# Altium schematic sheet SO_DO_DK_TONG_THE_MAY_GHI_HINH_9_9_2021.SchDoc
size A1
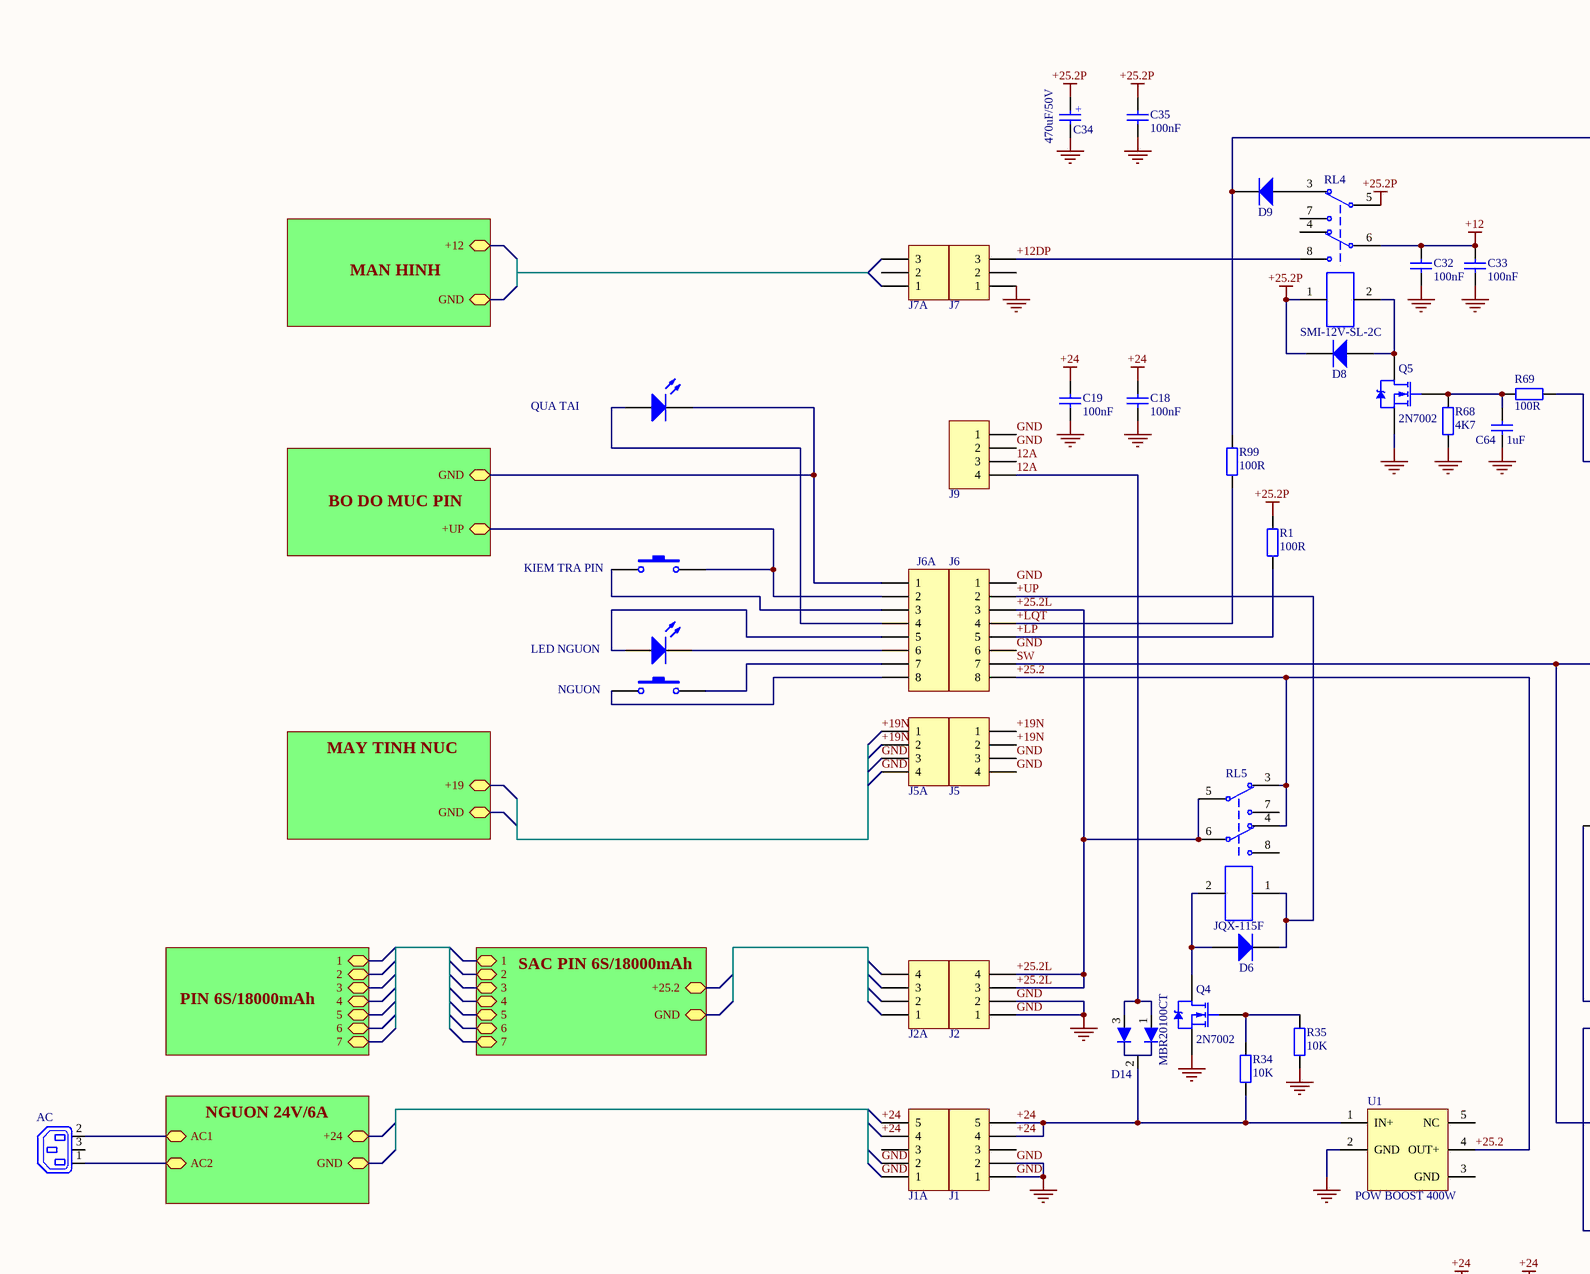
[diagram p0: SO_DO_DK_TONG_THE_MAY_GHI_HINH_9_9_2021.SchDoc, top left]
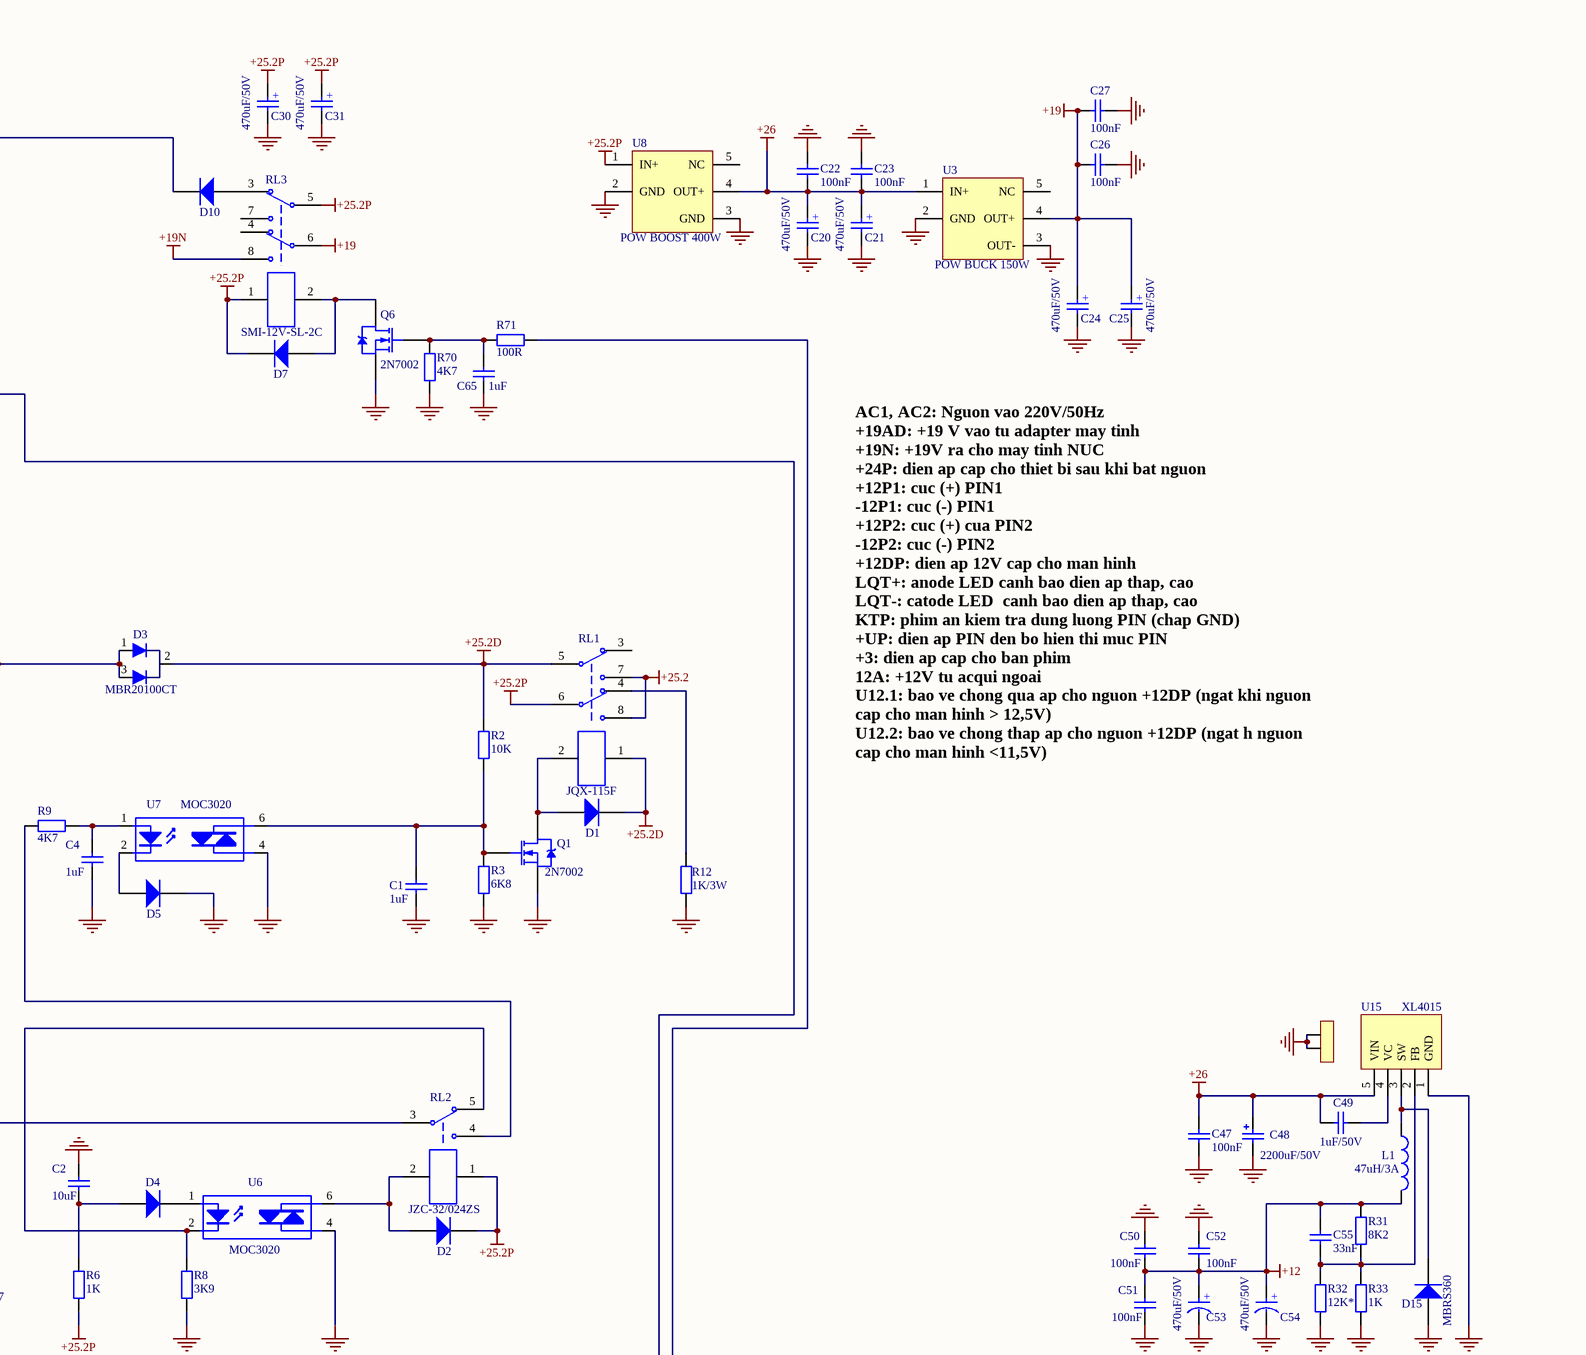
[diagram p1: SO_DO_DK_TONG_THE_MAY_GHI_HINH_9_9_2021.SchDoc, top right]
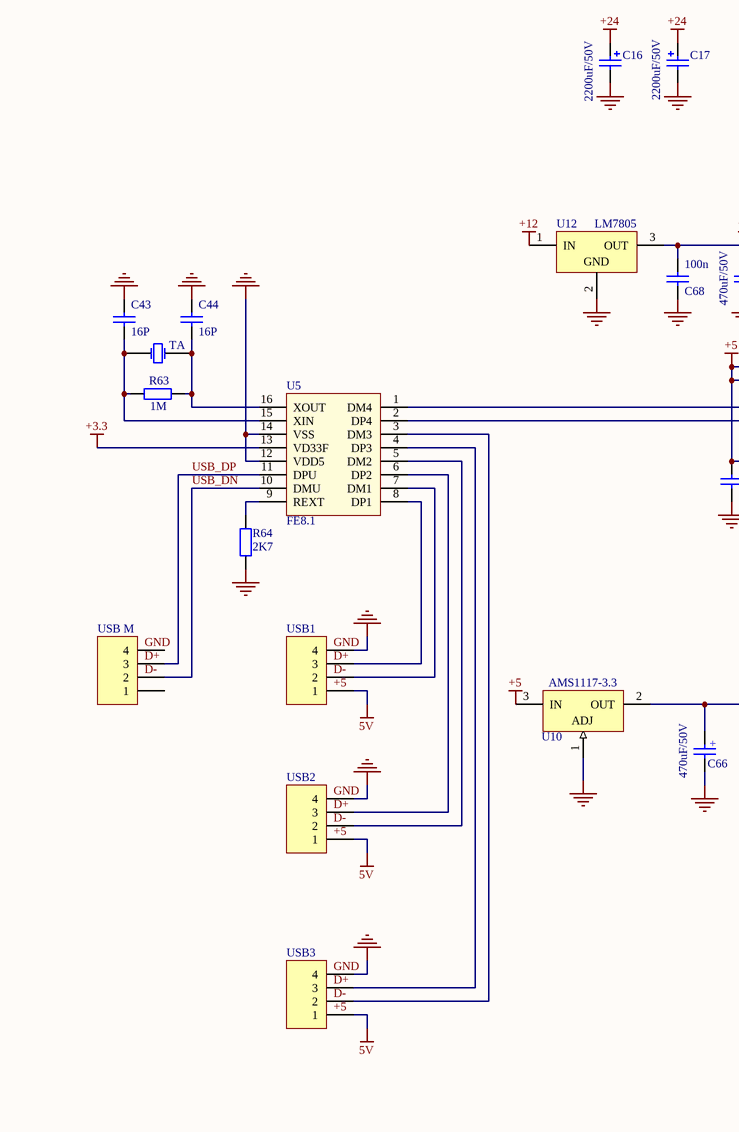
[diagram p2: SO_DO_DK_TONG_THE_MAY_GHI_HINH_9_9_2021.SchDoc, bottom left]
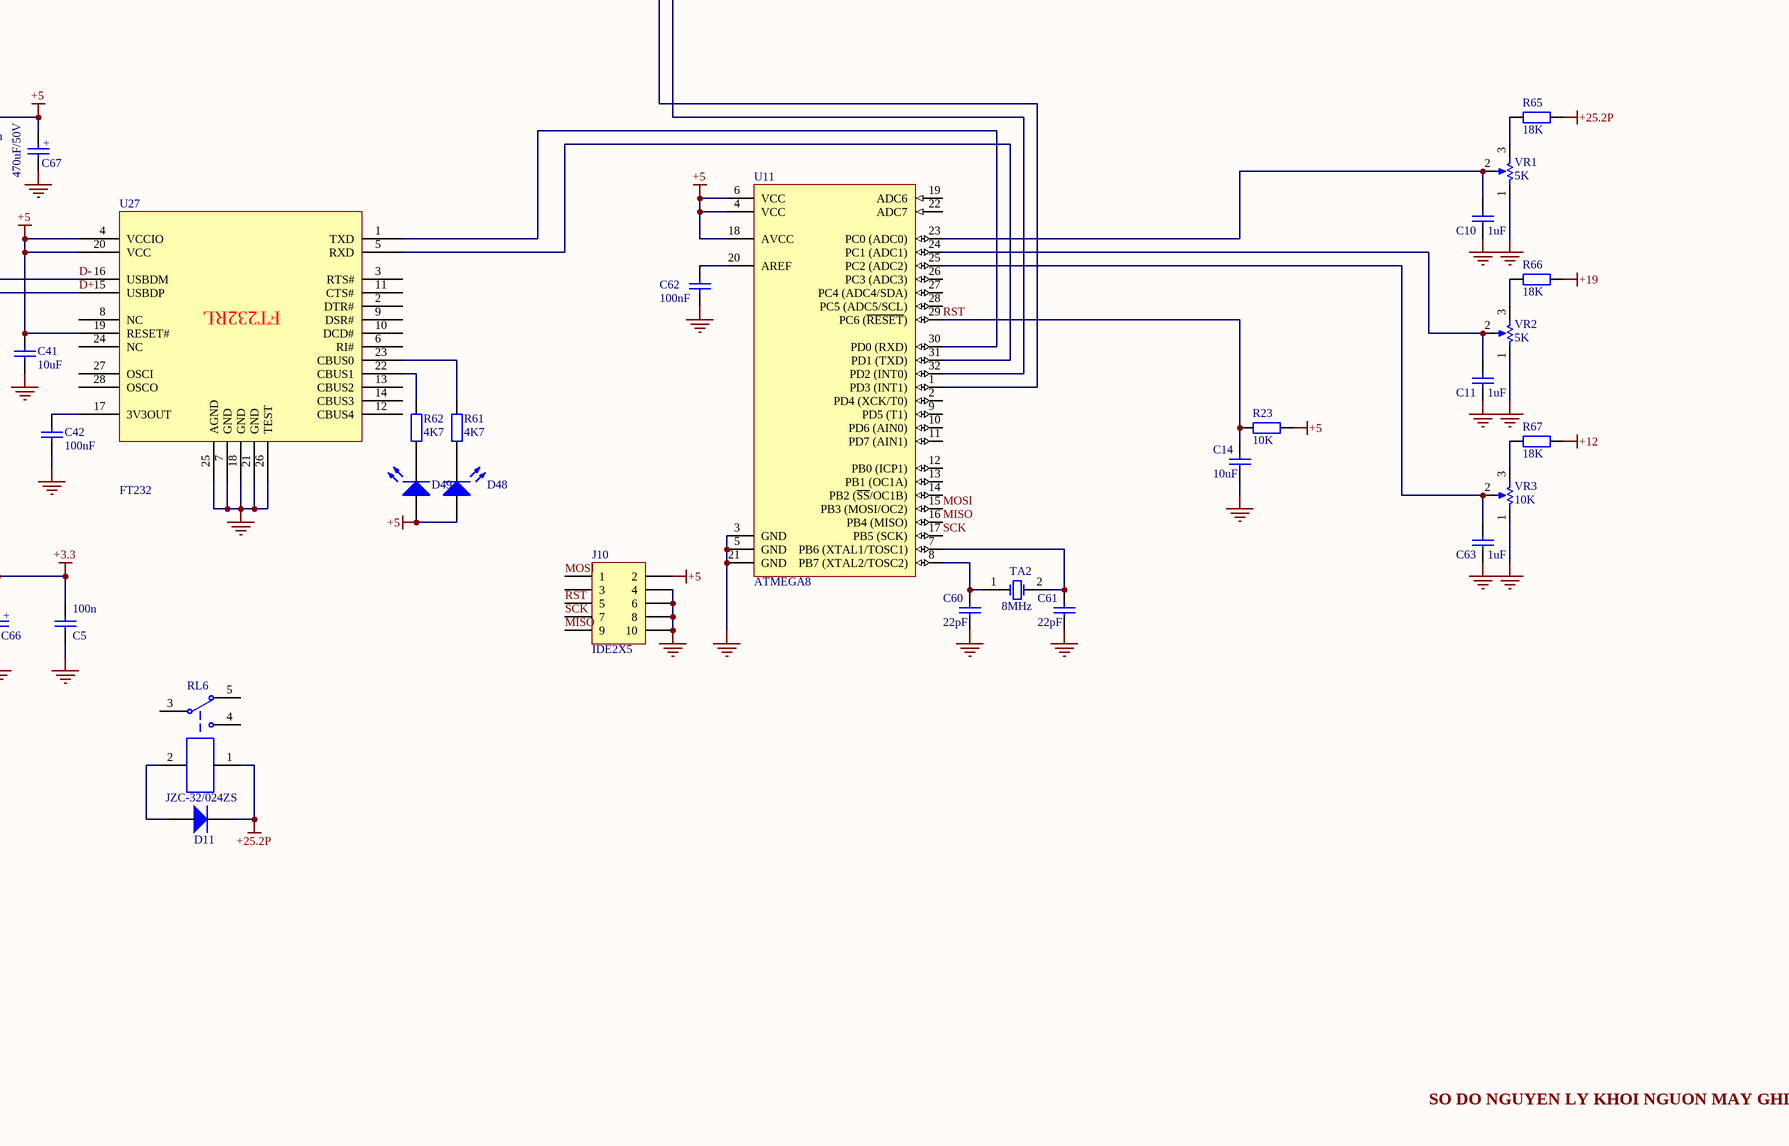
[diagram p3: SO_DO_DK_TONG_THE_MAY_GHI_HINH_9_9_2021.SchDoc, bottom right]

## Parts
AC  GN1  [IEC7-2H3]  (value not drawn)
C1  Tu_SMD  [RC_SMD]  (value not drawn)
C2  Tu_SMD  [RC_SMD]  (value not drawn)
C4  Tu_SMD  [RC_SMD]  (value not drawn)
C5  Tu_SMD  [PCB_SMD_0805]  (value not drawn)
C10  Tu_SMD  [RC_SMD]  (value not drawn)
C11  Tu_SMD  [RC_SMD]  (value not drawn)
C14  Tu_SMD  [PCB_SMD_0805]  (value not drawn)
C16  2200uF/50V  [tu_2200u/35]
C17  2200uF/50V  [tu_2200u/35]
C18  Tu_mica_100n  [RAD_0.3]  (value not drawn)
C19  Tu_mica_100n  [RAD_0.3]  (value not drawn)
C20  Tu_470u  [TU 470uF/50V]  (value not drawn)
C21  Tu_470u  [TU 470uF/50V]  (value not drawn)
C22  Tu_mica_100n  [RAD_0.3]  (value not drawn)
C23  Tu_mica_100n  [RAD_0.3]  (value not drawn)
C24  Tu_470u  [TU 470uF/50V]  (value not drawn)
C25  Tu_470u  [TU 470uF/50V]  (value not drawn)
C26  Tu_mica_100n  [RAD_0.3]  (value not drawn)
C27  Tu_mica_100n  [RAD_0.3]  (value not drawn)
C30  Tu_470u  [TU 470uF/50V]  (value not drawn)
C31  Tu_470u  [TU 470uF/50V]  (value not drawn)
C32  Tu_mica_100n  [RAD_0.3]  (value not drawn)
C33  Tu_mica_100n  [RAD_0.3]  (value not drawn)
C34  Tu_470u  [TU 470uF/50V]  (value not drawn)
C35  Tu_mica_100n  [RAD_0.3]  (value not drawn)
C41  Tu_SMD  [PCB_SMD_0805]  (value not drawn)
C42  Tu_SMD  [PCB_SMD_0805]  (value not drawn)
C43  Tu_SMD  [PCB_SMD_0805]  (value not drawn)
C44  Tu_SMD  [PCB_SMD_0805]  (value not drawn)
C47  Tu_mica_100n  [RAD_0.3]  (value not drawn)
C48  2200uF/50V  [tu_2200u/35]
C49  Tu_SMD  [PCB_SMD_0805]  (value not drawn)
C50  Tu_SMD  [PCB_SMD_0805]  (value not drawn)
C51  Tu_SMD  [PCB_SMD_0805]  (value not drawn)
C52  Tu_SMD  [PCB_SMD_0805]  (value not drawn)
C53  Tu_470u  [tu_470u_50V]  (value not drawn)
C54  Tu_470u  [tu_470u_50V]  (value not drawn)
C55  Tu_SMD  [RC_SMD]  (value not drawn)
C60  Tu_SMD  [PCB_SMD_0805]  (value not drawn)
C61  Tu_SMD  [PCB_SMD_0805]  (value not drawn)
C62  Tu_SMD  [PCB_SMD_0805]  (value not drawn)
C63  Tu_SMD  [RC_SMD]  (value not drawn)
C64  Tu_SMD  [RC_SMD]  (value not drawn)
C65  Tu_SMD  [RC_SMD]  (value not drawn)
C66  Tu_470u  [TU 470uF/50V]  (value not drawn)
C67  Tu_470u  [TU 470uF/50V]  (value not drawn)
C68  Tu_SMD  [PCB_SMD_0805]  (value not drawn)
D1  Diode_1A  [Diode_1A]  (value not drawn)
D2  Diode_1A  [Diode_1A]  (value not drawn)
D3  MBR20100CT  [TO220]
D4  Diode_1A  [Diode_1A]  (value not drawn)
D5  Diode_1A  [Diode_1A]  (value not drawn)
D6  Diode_1A  [Diode_1A]  (value not drawn)
D7  Diode_1A  [Diode_1A]  (value not drawn)
D8  Diode_1A  [Diode_1A]  (value not drawn)
D9  Diode_1A  [Diode_1A]  (value not drawn)
D10  Diode_1A  [Diode_1A]  (value not drawn)
D11  Diode_1A  [Diode_1A]  (value not drawn)
D14  MBR20100CT  [TO220]
D15  MBRS360  [DO-214AA]
D48  LED  [LED SMD]  (value not drawn)
D49  LED  [LED SMD]  (value not drawn)
J1  Header 3.96, 5P  [H396_5P]  (value not drawn)
J1A  Header 3.96, 5P  [H396_5P]  (value not drawn)
J2  Header 3.96, 4P  [H396_4P]  (value not drawn)
J2A  Header 3.96, 4P  [H396_4P]  (value not drawn)
J5  Header 3.96, 4P  [H396_4P]  (value not drawn)
J5A  Header 3.96, 4P  [H396_4P]  (value not drawn)
J6  Header 3.96, 8P  [H396_8P]  (value not drawn)
J6A  Header 3.96, 8P  [H396_8P]  (value not drawn)
J7  Header 3.96, 3P  [H396_3P]  (value not drawn)
J7A  Header 3.96, 3P  [H396_3P]  (value not drawn)
J9  Header 3.96, 4P  [H396_4P]  (value not drawn)
J10  IDE2X5  [IDE 2x5 DUC THANG]
KIEM_TRA_PIN  SW-PB  [SPST-2]  (value not drawn)
L1  47uH/3A  [CUON CAM 3A SMD]
LED_NGUON  LED0  [LED-0]  (value not drawn)
NGUON  SW-PB  [SPST-2]  (value not drawn)
Q1  2N7002  [SOT23]
Q4  2N7002  [SOT23]
Q5  2N7002  [SOT23]
Q6  2N7002  [SOT23]
QUA_TAI  LED0  [LED-0]  (value not drawn)
R1  Tro_SMD  [RC_SMD]  (value not drawn)
R2  Tro_SMD  [RC_SMD]  (value not drawn)
R3  Tro_SMD  [RC_SMD]  (value not drawn)
R6  Tro_SMD  [RC_SMD]  (value not drawn)
R8  Tro_SMD  [RC_SMD]  (value not drawn)
R9  Tro_SMD  [RC_SMD]  (value not drawn)
R12  Dien_tro_2W  [R-2W]  (value not drawn)
R23  Tro_SMD  [PCB_SMD_0805]  (value not drawn)
R31  Tro_SMD  [PCB_SMD_0805]  (value not drawn)
R32  Tro_SMD  [PCB_SMD_0805]  (value not drawn)
R33  Tro_SMD  [PCB_SMD_0805]  (value not drawn)
R34  Tro_SMD  [RC_SMD]  (value not drawn)
R35  Tro_SMD  [RC_SMD]  (value not drawn)
R61  Tro_SMD  [RC_SMD]  (value not drawn)
R62  Tro_SMD  [RC_SMD]  (value not drawn)
R63  Tro_SMD  [RC_SMD]  (value not drawn)
R64  Tro_SMD  [RC_SMD]  (value not drawn)
R65  Tro_SMD  [PCB_SMD_0805]  (value not drawn)
R66  Tro_SMD  [PCB_SMD_0805]  (value not drawn)
R67  Tro_SMD  [PCB_SMD_0805]  (value not drawn)
R68  Tro_SMD  [PCB_SMD_0805]  (value not drawn)
R69  Tro_SMD  [PCB_SMD_0805]  (value not drawn)
R70  Tro_SMD  [PCB_SMD_0805]  (value not drawn)
R71  Tro_SMD  [PCB_SMD_0805]  (value not drawn)
R99  Tro_SMD  [RC_SMD]  (value not drawn)
RL1  JQX-115F  [Role_SMI-24VDC-SL-2C]
RL2  JZC-32/024ZS  [JZC-32F/024ZS]
RL3  SMI-12V-SL-2C  [Role_SMI-24VDC-SL-2C]
RL4  SMI-12V-SL-2C  [Role_SMI-24VDC-SL-2C]
RL5  JQX-115F  [Role_SMI-24VDC-SL-2C]
RL6  JZC-32/024ZS  [JZC-32F/024ZS]
TA  TA  [PCB TA SMD]  (value not drawn)
TA2  8MHz  [TA]
TN2  TAN NHIET CPU  [TAN_NHIET_CPU]  (value not drawn)
U1  POW BOOST 400W  [PCB NGUON BOOST 400W]
U3  POW BUCK 150W  [PCB Nguon BUCK BOOST 150W]
U5  FE8.1  [PCB FE8.1]
U6  MOC3020  [DIP6]
U7  MOC3020  [DIP6]
U8  POW BOOST 400W  [PCB NGUON BOOST 400W]
U10  AMS1117-3.3  [SOT-223VN]
U11  ATMEGA8  [ATMEGA8VN]
U12  LM7805  [TO-252]
U15  XL4015  [TO-263-5L]
U27  FT232  [SSOP28]
USB1  H4P254  [Jac_4P_nho]  (value not drawn)
USB2  H4P254  [Jac_4P_nho]  (value not drawn)
USB3  H4P254  [Jac_4P_nho]  (value not drawn)
USB_M  H4P254  [Jac_4P_nho]  (value not drawn)
VR1  Chiet_ap_vi_chinh  [PCB Chiet ap vi chinh 3296]  (value not drawn)
VR2  Chiet_ap_vi_chinh  [PCB Chiet ap vi chinh 3296]  (value not drawn)
VR3  Chiet_ap_vi_chinh  [PCB Chiet ap vi chinh 3296]  (value not drawn)

## Sub-sheets
BO DO MUC PIN = File Name: GND, +UP
MAN HINH = File Name: +12, GND
MAY TINH NUC = File Name: +19, GND
NGUON 24V/6A = File Name: AC1, AC2, +24, GND
PIN 6S/18000mAh = File Name: 1, 2, 3, 4, 5, 6, 7
SAC PIN 6S/18000mAh = File Name: +25.2, GND, 1, 2, 3, 4, 5, 6, 7

## Nets
5V: USB1.1 USB2.1 USB3.1
+3.3: C5.2 C66.1 U5.13(VD33F) U10.2(OUT)
+5: C41.1 C67.1 C68.2 D48.1(A) D49.1(A) J10.2 R23.2 U10.3(IN) U11.4(VCC) U11.6(VCC) U11.18(AVCC) U12.3(OUT) U27.4(VCCIO) U27.19(RESET#) U27.20(VCC)
+12: C32.1 C33.2 C50.1 C51.1 C52.1 C53.1 C54.1 C55.2 L1.2 R31.2 R67.2 RL4.6 U12.1(IN)
+19: C24.1 C25.1 C26.1 C27.2 R66.2 RL3.6 U3.4(OUT+)
+19N: J5.1 J5.2 J5A.1 J5A.2 RL3.8
+24: C16.1 C17.1 C18.2 C19.2 D14.2 J1.4 J1.5 J1A.4 J1A.5 R34.1 U1.1(IN+)
+25.2: J6.8 RL1.7 RL1.8 RL5.3 RL5.4 U1.4(OUT+)
+25.2D: D1.2 D3.2 R2.1 RL1.1 RL1.5
+25.2P: C30.1 C31.1 C34.1 C35.2 D2.2 D7.2 D8.2 D11.2 R1.2 R6.1 R65.2 RL1.6 RL2.1 RL3.1 RL3.5 RL4.1 RL4.5 RL6.1 U8.1(IN+)
+26: C20.1 C21.1 C22.2 C23.1 C47.2 C48.1 C49.1 U3.1(IN+) U8.4(OUT+) U15.5(VIN)
GND: C1.1 C2.2 C4.1 C5.1 C10.1 C11.1 C14.1 C16.2 C17.2 C18.1 C19.1 C20.2 C21.2 C22.1 C23.2 C24.2 C25.2 C26.2 C27.1 C30.2 C31.2 C32.2 C33.1 C34.2 C35.1 C41.2 C42.2 C43.2 C44.2 C47.1 C48.2 C50.2 C51.2 C52.2 C53.2 C54.2 C60.1 C61.1 C62.1 C63.1 C64.1 C65.1 C66.2 C67.2 C68.1 D5.2 D15.2 J1.1 J1.2 J1A.1 J1A.2 J2.1 J2.2 J5.3 J5.4 J5A.3 J5A.4 J6.1 J6.6 J7.1 J9.1 J9.2 J10.4 J10.6 J10.8 J10.10 Q1.3(S) Q4.3(S) Q5.3(S) Q6.3(S) R3.2 R8.1 R12.2 R32.1 R33.1 R35.1 R64.1 R68.1 R70.1 TN2.1 TN2.2 U1.2(GND) U3.2(GND) U3.3(OUT-) U5.12(VDD5) U5.14(VSS) U6.4(A/K) U7.4(A/K) U8.2(GND) U8.3(GND) U10.1(ADJ) U11.3(GND) U11.5(GND) U11.21(GND) U12.2(GND) U15.1(GND) U27.7(GND) U27.18(GND) U27.21(GND) U27.25(AGND) U27.26(TEST) USB1.4 USB2.4 USB3.4 VR1.1(TOP) VR2.1(TOP) VR3.1(TOP)
12A: D14.1 D14.3 J9.3 J9.4
+12DP: J7.3 RL4.8
+25.2L: J2.3 J2.4 J6.3 RL5.5 RL5.6
+LP: J6.5 R1.1
+LQT: J6.4 R99.1
+UP: D6.2 J6.2 RL5.1
D+: U5.2(DP4) U27.15(USBDP)
D-: U5.1(DM4) U27.16(USBDM)
MISO: J10.9 U11.16(PB4_(MISO))
MOSI: J10.1 U11.15(PB3_(MOSI/OC2))
RST: C14.2 J10.5 R23.1 U11.29(PC6_(~{RESET}))
SCK: J10.7 U11.17(PB5_(SCK))
SW: D3.1 D3.3 J6.7 RL2.3
USB_DN: U5.10(DMU) USB_M.2
USB_DP: U5.11(DPU) USB_M.3
NetAC_1: AC.1(L) ; sheet NGUON 24V/6A/AC2
NetAC_2: AC.2(N) ; sheet NGUON 24V/6A/AC1
NetC1_2: C1.2 Q1.1(G) R2.2 R3.1 U7.6(A/K)
NetC2_1: C2.1 D4.1 R6.2
NetC4_2: C4.2 R9.2 U7.1(A)
NetC10_2: C10.2 U11.23(PC0_(ADC0)) VR1.2(TAP)
NetC11_2: C11.2 U11.24(PC1_(ADC1)) VR2.2(TAP)
NetC42_1: C42.1 U27.17(3V3OUT)
NetC43_1: C43.1 R63.2 TA.1(OSC1) U5.15(XIN)
NetC44_1: C44.1 R63.1 TA.2(OSC2) U5.16(XOUT)
NetC49_2: C49.2 U15.4(VC)
NetC55_1: C55.1 R31.1 R32.2 R33.2 U15.2(FB)
NetC60_2: C60.2 TA2.1(OSC1) U11.8(PB7_(XTAL2/TOSC2))
NetC61_2: C61.2 TA2.2(OSC2) U11.7(PB6_(XTAL1/TOSC1))
NetC62_2: C62.2 U11.20(AREF)
NetC63_2: C63.2 U11.25(PC2_(ADC2)) VR3.2(TAP)
NetC64_2: C64.2 Q5.1(G) R68.2 R69.1
NetC65_2: C65.2 Q6.1(G) R70.2 R71.1
NetD1_1: D1.1 Q1.2(D) RL1.2
NetD2_1: D2.1 RL2.2 U6.6(A/K)
NetD4_2: D4.2 U6.1(A)
NetD5_1: D5.1 U7.2(K)
NetD6_1: D6.1 Q4.2(D) RL5.2
NetD7_1: D7.1 Q6.2(D) RL3.2
NetD8_1: D8.1 Q5.2(D) RL4.2
NetD9_1: D9.1 RL4.3
NetD9_2: D9.2 D10.2 R99.2
NetD10_1: D10.1 RL3.3
NetD11_1: D11.1 RL6.2
NetD15_1: D15.1 L1.1 U15.3(SW)
NetD48_2: D48.2(K) R61.1
NetD49_2: D49.2(K) R62.1
NetJ6A_1: J6A.1 QUA_TAI.2(K) ; sheet BO DO MUC PIN/GND
NetJ6A_2: J6A.2 KIEM_TRA_PIN.2 ; sheet BO DO MUC PIN/+UP
NetJ6A_3: J6A.3 KIEM_TRA_PIN.1
NetJ6A_4: J6A.4 QUA_TAI.1(A)
NetJ6A_5: J6A.5 LED_NGUON.1(A)
NetJ6A_6: J6A.6 LED_NGUON.2(K)
NetJ6A_7: J6A.7 NGUON.2
NetJ6A_8: J6A.8 NGUON.1
NetQ4_1: Q4.1(G) R34.2 R35.2
NetR8_2: R8.2 RL2.5 U6.2(K)
NetR9_1: R9.1 RL2.4
NetR12_1: R12.1 RL1.4
NetR61_2: R61.2 U27.23(CBUS0)
NetR62_2: R62.2 U27.22(CBUS1)
NetR64_2: R64.2 U5.9(REXT)
NetR65_1: R65.1 VR1.3(BOT)
NetR66_1: R66.1 VR2.3(BOT)
NetR67_1: R67.1 VR3.3(BOT)
NetR69_2: R69.2 U11.1(PD3_(INT1))
NetR71_2: R71.2 U11.32(PD2_(INT0))
NetU5_3: U5.3(DM3) USB3.2
NetU5_4: U5.4(DP3) USB3.3
NetU5_5: U5.5(DM2) USB2.2
NetU5_6: U5.6(DP2) USB2.3
NetU5_7: U5.7(DM1) USB1.2
NetU5_8: U5.8(DP1) USB1.3
NetU11_30: U11.30(PD0_(RXD)) U27.1(TXD)
NetU11_31: U11.31(PD1_(TXD)) U27.5(RXD)

Not connected (* = marked no-connect by the designer): AC 3(E); J1 3; J1A 3; J2A 1 2 3 4; J7 2; J7A 1 2 3; J10 3; RL1 3; RL3 4 7; RL4 4 7; RL5 7 8; RL6 3 4 5; U1 3(GND) 5(NC); U3 5(NC); U8 5(NC); U11 2(PD4_(XCK/T0)) 9(PD5_(T1)) 10(PD6_(AIN0)) 11(PD7_(AIN1)) 12(PB0_(ICP1)) 13(PB1_(OC1A)) 14(PB2_(~{SS}/OC1B)) 19(ADC6) 22(ADC7) 26(PC3_(ADC3)) 27(PC4_(ADC4/SDA)) 28(PC5_(ADC5/SCL)); U27 2(DTR#) 3(RTS#) 6(RI#) 8(NC) 9(DSR#) 10(DCD#) 11(CTS#) 12(CBUS4) 13(CBUS2) 14(CBUS3) 24(NC) 27(OSCI) 28(OSCO); USB_M 1 4

## Notes on the sheet
- AC1, AC2: Nguon vao 220V/50Hz
  +19AD: +19 V vao tu adapter may tinh
  +19N: +19V ra cho may tinh NUC
  +24P: dien ap cap cho thiet bi sau khi bat nguon
  +12P1: cuc (+) PIN1
  -12P1: cuc (-) PIN1
  +12P2: cuc (+) cua PIN2
  -12P2: cuc (-) PIN2
  +12DP: dien ap 12V cap cho man hinh
  LQT+: anode LED canh bao dien ap thap, cao
  LQT-: catode LED  canh bao dien ap thap, cao
  KTP: phim an kiem tra dung luong PIN (chap GND)
  +UP: dien ap PIN den bo hien thi muc PIN
  +3: dien ap cap cho ban phim
  12A: +12V tu acqui ngoai
  U12.1: bao ve chong qua ap cho nguon +12DP (ngat khi nguon cap cho man hinh > 12,5V)
  U12.2: bao ve chong thap ap cho nguon +12DP (ngat h nguon cap cho man hinh <11,5V)
- (near USB_M) GND
- (near USB_M) D+
- (near USB_M) D-
- (near USB1) GND
- (near USB1) D+
- (near USB1) D-
- (near USB1) +5
- (near USB2) GND
- (near USB2) D+
- (near USB2) D-
- (near USB2) +5
- (near USB3) GND
- (near USB3) D+
- (near USB3) D-
- (near USB3) +5
- SO DO NGUYEN LY KHOI NGUON MAY GHI HINH
- (in symbol Chiet_ap_vi_chinh) 5K; 10K
- (in symbol Dien_tro_2W) 1K/3W
- (in symbol FT232) FT232RL
- (in symbol Tro_SMD) 10K; 6K8; 1K; 3K9; 4K7; 100R; 8K2; 12K*; 1M; 2K7; 18K
- (in symbol Tu_470u) +; 470uF/50V
- (in symbol Tu_mica_100n) 100nF
- (in symbol Tu_SMD) 1uF; 10uF; 33nF; 100nF; 1uF/50V; 16P; 22pF; 100n

## Library data of the parts
AC = Plug AC Female: IEC Mains Power Outlet, EN60 320-2-2 F Class I, PC Flange Rear Mount, Chassis Socket; PackageDocument: ver.80, 15-Sep-2003; MaximumRating: 10A, 250V a.c. (UL & CSA 15A, 250V a.c.); MountingFixtures: Not drawn on schematic symbol.; PCB_Layout: Complies with manufacturer's recommendation.; DrillSize: Corresponds to nominal value.; Published: 15-Jul-2004; LatestRevisionDate: 15-Jul-2004; LatestRevisionNote: Component Replaced & renamed from "Phonejack".; DatasheetDocument: ver.80, 15-Sep-2003; PackageReference: PX0675/PC; Publisher: Altium Limited; Terminations: P.C. Spills; ComponentLink1Description: Manufacturer Link; ComponentLink1URL: http://www.bulgin.co.uk/
C16 C17 C48 = Tu 2200uF/50V
D3 D14 = MUR3020
D15 = Diode 5A
D48 D49 = LED_SMD
J1 J1A = H396_5P
J2 J2A J5 J5A J9 = H396_4P
J6 J6A = H396_8P
J7 J7A = H396_3P
KIEM_TRA_PIN NGUON = SW-PB: Switch; Published: 24-Mar-1999; LatestRevisionDate: 17-Jul-2002; LatestRevisionNote: Re-released for DXP Platform.; PackageReference: SPST-2; Publisher: Altium Limited; PackageDescription: Switch; 2 Leads
L1 = CUON CAM 3A SMD
LED_NGUON QUA_TAI = LED0: Typical INFRARED GaAs LED; Published: 8-Jun-2000; LatestRevisionDate: 08-Jul-2005; LatestRevisionNote: Mech Layer 1 removed.; PackageReference: LED-0; Publisher: Altium Limited; PackageDescription: LED; 2 Leads
RL1 RL3-RL5 = Role_SMI_24V_SL_2C
RL2 RL6 = RELAY JZC-32/024ZS
TA2 = TA
U1 U8 = Nguon BOOST 150W
U3 = Nguon BUCK 150W
U10 = LM317
U11 = ATMEGA8VN
U12 = L7805
U15 = XL4015VN